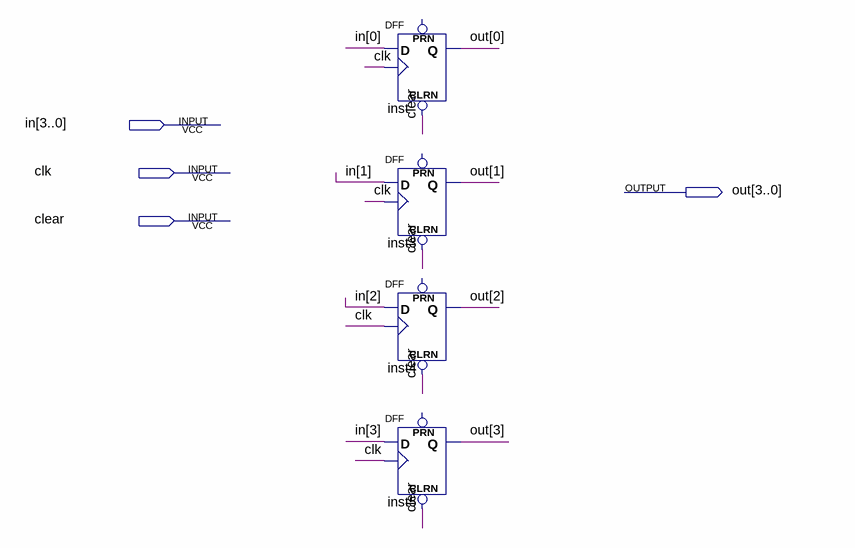
[diagram p0: schematic sheet]
// Quartus schematic dff_4bit.bdf as structural Verilog: 4 symbols, 4 pins
module dff_4bit (
  input  [3:0] in,
  input  clk,
  input  clear,
  output [3:0] out
);

  DFF inst (.CLRN(clear), .CLK(clk), .D(in[0]), .Q(out[0]));  // open: PRN
  DFF inst3 (.CLRN(clear), .CLK(clk), .D(in[1]), .Q(out[1]));  // open: PRN
  DFF inst4 (.CLRN(clear), .CLK(clk), .D(in[2]), .Q(out[2]));  // open: PRN
  DFF inst5 (.CLRN(clear), .CLK(clk), .D(in[3]), .Q(out[3]));  // open: PRN
endmodule
